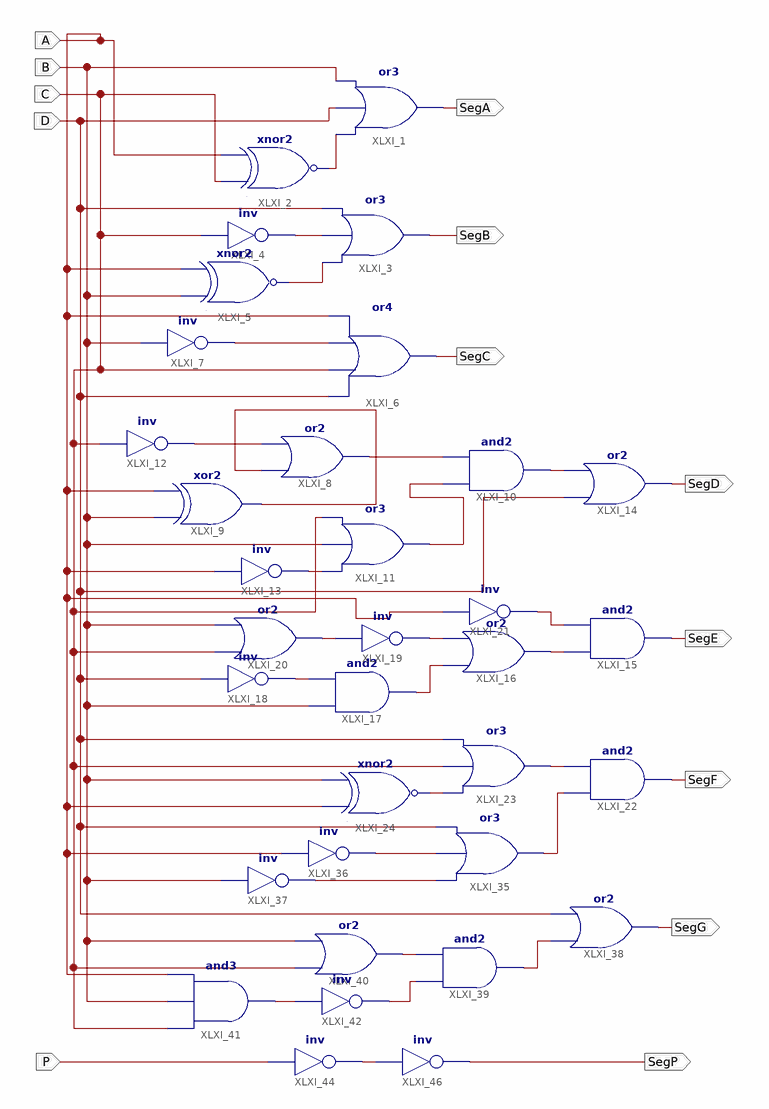
[diagram p0: schematic sheet 1]
// Xilinx ISE schematic SevenSeg.sch (spartan6) as structural Verilog: 34 symbols, 13 ports
module SevenSeg (
  input  C,
  input  B,
  input  A,
  input  D,
  input  P,
  output SegA,
  output SegC,
  output SegB,
  output SegD,
  output SegE,
  output SegF,
  output SegG,
  output SegP
);

  wire XLXN_1, XLXN_9, XLXN_10, XLXN_11, XLXN_55, XLXN_60, XLXN_61, XLXN_64, XLXN_76, XLXN_79, XLXN_82,
       XLXN_83, XLXN_84, XLXN_87, XLXN_88, XLXN_91, XLXN_93, XLXN_96, XLXN_99, XLXN_102, XLXN_105, XLXN_111,
       XLXN_112, XLXN_113, XLXN_114, XLXN_116;

  or XLXI_1 (SegA, XLXN_1, D, B);
  xnor XLXI_2 (XLXN_1, C, A);
  or XLXI_3 (SegB, XLXN_10, XLXN_9, D);
  not XLXI_4 (XLXN_9, C);
  xnor XLXI_5 (XLXN_10, B, A);
  or XLXI_6 (SegC, D, C, XLXN_11, A);
  not XLXI_7 (XLXN_11, B);
  or XLXI_8 (XLXN_55, XLXN_61, XLXN_60);
  xor XLXI_9 (XLXN_61, B, A);
  and XLXI_10 (XLXN_79, XLXN_64, XLXN_55);
  or XLXI_11 (XLXN_64, XLXN_76, B, C);
  not XLXI_12 (XLXN_60, C);
  not XLXI_13 (XLXN_76, A);
  or XLXI_14 (SegD, D, XLXN_79);
  and XLXI_15 (SegE, XLXN_82, XLXN_91);
  or XLXI_16 (XLXN_82, XLXN_83, XLXN_87);
  and XLXI_17 (XLXN_83, B, XLXN_84);
  not XLXI_18 (XLXN_84, D);
  not XLXI_19 (XLXN_87, XLXN_88);
  or XLXI_20 (XLXN_88, C, B);
  not XLXI_21 (XLXN_91, A);
  and XLXI_22 (SegF, XLXN_99, XLXN_93);
  or XLXI_23 (XLXN_93, XLXN_96, C, D);
  xnor XLXI_24 (XLXN_96, A, B);
  or XLXI_35 (XLXN_99, XLXN_105, XLXN_102, D);
  not XLXI_36 (XLXN_102, A);
  not XLXI_37 (XLXN_105, B);
  or XLXI_38 (SegG, XLXN_111, D);
  and XLXI_39 (XLXN_111, XLXN_114, XLXN_112);
  or XLXI_40 (XLXN_112, C, B);
  and XLXI_41 (XLXN_113, C, B, A);
  not XLXI_42 (XLXN_114, XLXN_113);
  not XLXI_44 (XLXN_116, P);
  not XLXI_46 (SegP, XLXN_116);
endmodule
